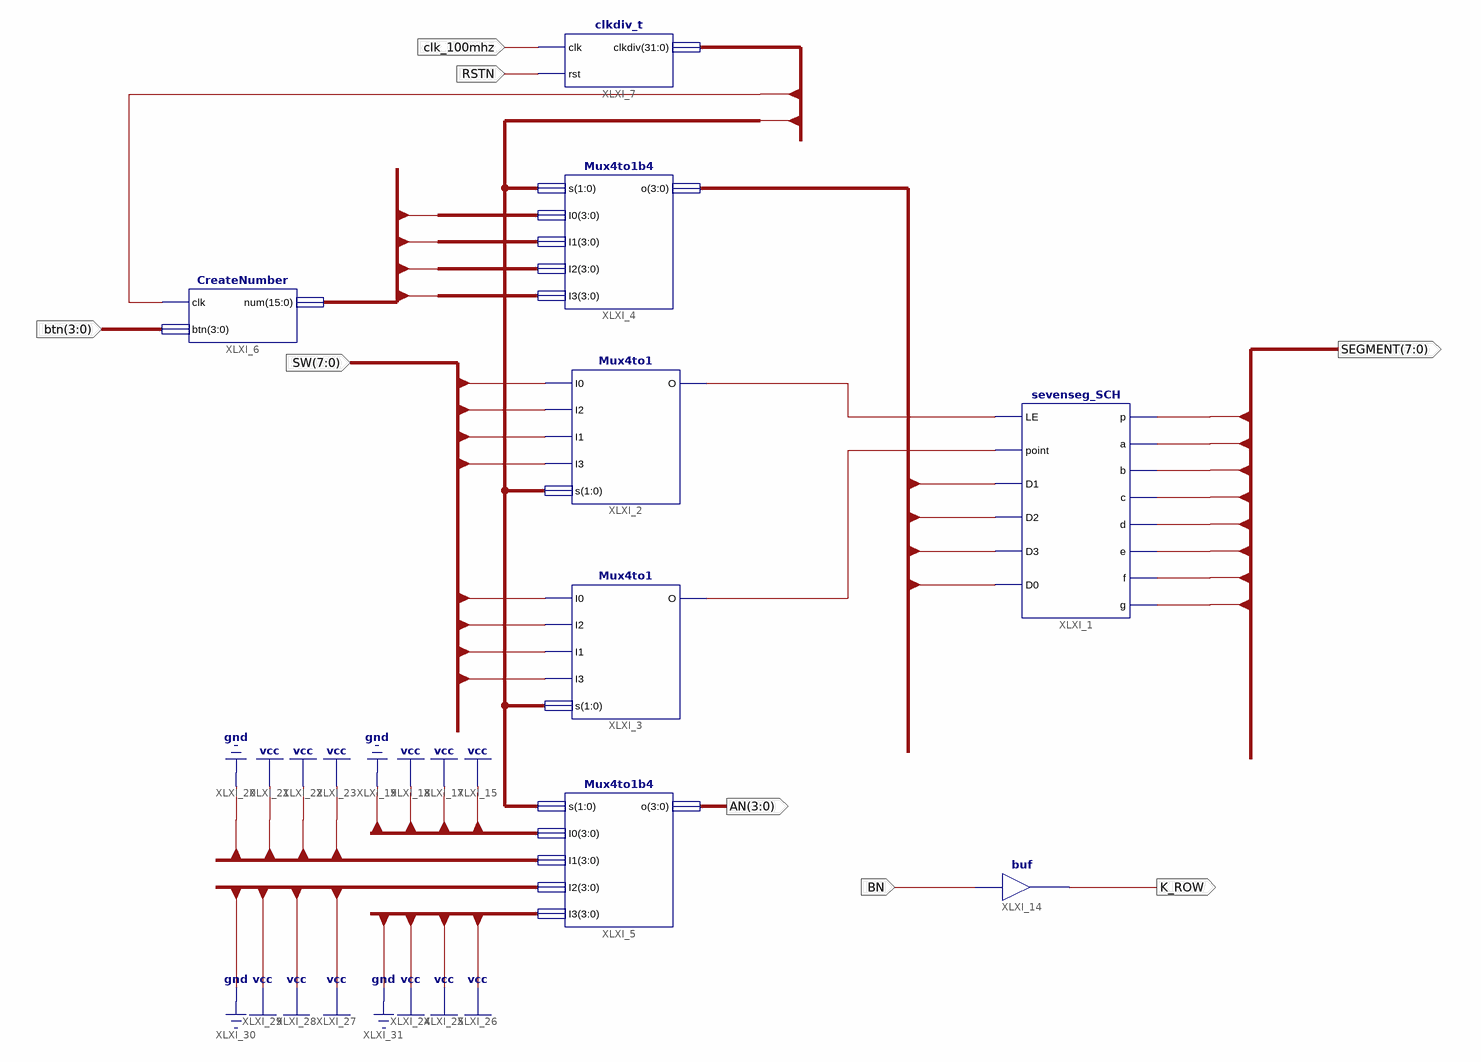
[diagram p0: schematic sheet 1]
// Xilinx ISE schematic scoreboard_sch.sch (kintex7) as structural Verilog: 8 symbols, 8 ports
module scoreboard_sch (
  input  [7:0] SW,
  input  [3:0] btn,
  input  BN,
  input  clk_100mhz,
  input  RSTN,
  output [7:0] SEGMENT,
  output K_ROW,
  output [3:0] AN
);

  wire XLXN_23, XLXN_24;
  wire [3:0] o;
  wire [15:0] num;
  wire [31:0] clkdiv;

  sevenseg_SCH XLXI_1 (
    .LE(XLXN_23), .point(XLXN_24), .D1(o[1]), .D2(o[2]), .D3(o[3]), .D0(o[0]), .p(SEGMENT[7]),
    .a(SEGMENT[0]), .b(SEGMENT[1]), .c(SEGMENT[2]), .d(SEGMENT[3]), .e(SEGMENT[4]), .f(SEGMENT[5]),
    .g(SEGMENT[6]));
  Mux4to1 XLXI_2 (.I0(SW[0]), .I2(SW[2]), .I1(SW[1]), .I3(SW[3]), .s(clkdiv[18:17]), .O(XLXN_23));
  Mux4to1 XLXI_3 (.I0(SW[4]), .I2(SW[6]), .I1(SW[5]), .I3(SW[7]), .s(clkdiv[18:17]), .O(XLXN_24));
  Mux4to1b4 XLXI_4 (.s(clkdiv[18:17]), .I0(num[3:0]), .I1(num[7:4]), .I2(num[11:8]), .I3(num[15:12]), .o(o));
  Mux4to1b4 XLXI_5 (.s(clkdiv[18:17]), .I0(4'b1110), .I1(4'b1101), .I2(4'b1011), .I3(4'b0111), .o(AN));
  CreateNumber XLXI_6 (.clk(clkdiv[17]), .btn(btn), .num(num));
  clkdiv_t XLXI_7 (.clk(clk_100mhz), .rst(RSTN), .clkdiv(clkdiv));
  buf XLXI_14 (K_ROW, BN);
endmodule
